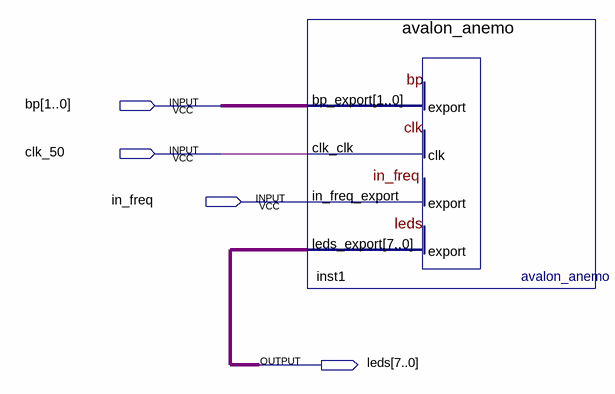
[diagram p0: schematic sheet]
// Quartus schematic avalon_anemometre.bdf as structural Verilog: 1 symbols, 4 pins
module avalon_anemometre (
  input  [1:0] bp,
  input  clk_50,
  input  in_freq,
  output [7:0] leds
);

  avalon_anemo inst1 (.bp_export(bp), .clk_clk(clk_50), .in_freq_export(in_freq), .leds_export(leds));
endmodule
